# Altium schematic sheet ComponentsSchLib.SchDoc
size A4
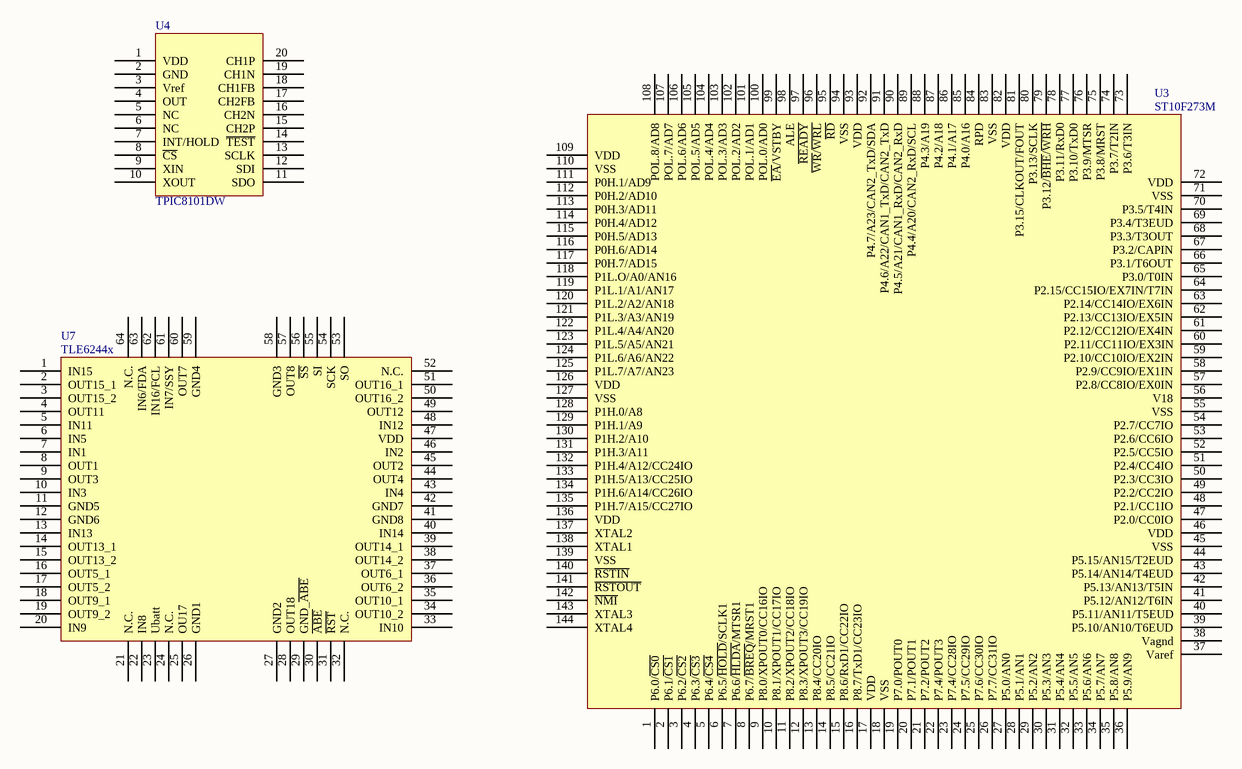
[diagram p0: ComponentsSchLib.SchDoc]

## Parts
U3  ST10F273M  [SOMQ144-Y]
U4  TPIC8101DW  [SO20_N]
U7  TLE6244x  [MQFP-64-10]

## Nets
gnd: U7.65(GND)

Not connected (* = marked no-connect by the designer): U3 1(P6.0/~{CS0}) 2(P6.1/~{CS1}) 3(P6.2/~{CS2}) 4(P6.3/~{CS3}) 5(P6.4/~{CS4}) 6(P6.5/~{HOLD}/SCLK1) 7(P6.6/~{HLDA}/MTSR1) 8(P6.7/~{BREQ}/MRST1) 9(P8.0/XPOUT0/CC16IO) 10(P8.1/XPOUT1/CC17IO) 11(P8.2/XPOUT2/CC18IO) 12(P8.3/XPOUT3/CC19IO) 13(P8.4/CC20IO) 14(P8.5/CC21IO) 15(P8.6/RxD1/CC22IO) 16(P8.7/TxD1/CC23IO) 17(VDD) 18(VSS) 19(P7.0/POUT0) 20(P7.1/POUT1) 21(P7.2/POUT2) 22(P7.4/POUT3) 23(P7.4/CC28IO) 24(P7.5/CC29IO) 25(P7.6/CC30IO) 26(P7.7/CC31IO) 27(P5.0/AN0) 28(P5.1/AN1) 29(P5.2/AN2) 30(P5.3/AN3) 31(P5.4/AN4) 32(P5.5/AN5) 33(P5.6/AN6) 34(P5.7/AN7) 35(P5.8/AN8) 36(P5.9/AN9) 37(Varef) 38(Vagnd) 39(P5.10/AN10/T6EUD) 40(P5.11/AN11/T5EUD) 41(P5.12/AN12/T6IN) 42(P5.13/AN13/T5IN) 43(P5.14/AN14/T4EUD) 44(P5.15/AN15/T2EUD) 45(VSS) 46(VDD) 47(P2.0/CC0IO) 48(P2.1/CC1IO) 49(P2.2/CC2IO) 50(P2.3/CC3IO) 51(P2.4/CC4IO) 52(P2.5/CC5IO) 53(P2.6/CC6IO) 54(P2.7/CC7IO) 55(VSS) 56(V18) 57(P2.8/CC8IO/EX0IN) 58(P2.9/CC9IO/EX1IN) 59(P2.10/CC10IO/EX2IN) 60(P2.11/CC11IO/EX3IN) 61(P2.12/CC12IO/EX4IN) 62(P2.13/CC13IO/EX5IN) 63(P2.14/CC14IO/EX6IN) 64(P2.15/CC15IO/EX7IN/T7IN) 65(P3.0/T0IN) 66(P3.1/T6OUT) 67(P3.2/CAPIN) 68(P3.3/T3OUT) 69(P3.4/T3EUD) 70(P3.5/T4IN) 71(VSS) 72(VDD) 73(P3.6/T3IN) 74(P3.7/T2IN) 75(P3.8/MRST) 76(P3.9/MTSR) 77(P3.10/TxD0) 78(P3.11/RxD0) 79(P3.12/~{BHE}/~{WRH}) 80(P3.13/SCLK) 81(P3.15/CLKOUT/FOUT) 82(VDD) 83(VSS) 84(RPD) 85(P4.0/A16) 86(P4.1/A17) 87(P4.2/A18) 88(P4.3/A19) 89(P4.4/A20/CAN2_RxD/SCL) 90(P4.5/A21/CAN1_RxD/CAN2_RxD) 91(P4.6/A22/CAN1_TxD/CAN2_TxD) 92(P4.7/A23/CAN2_TxD/SDA) 93(VDD) 94(VSS) 95(~{RD}) 96(~{WR}/~{WRL}) 97(~{READY}) 98(ALE) 99(~{EA}/VSTBY) 100(POL.0/AD0) 101(POL.1/AD1) 102(POL.2/AD2) 103(POL.3/AD3) 104(POL.4/AD4) 105(POL.5/AD5) 106(POL.6/AD6) 107(POL.7/AD7) 108(POL.8/AD8) 109(VDD) 110(VSS) 111(P0H.1/AD9) 112(P0H.2/AD10) 113(P0H.3/AD11) 114(P0H.4/AD12) 115(P0H.5/AD13) 116(P0H.6/AD14) 117(P0H.7/AD15) 118(P1L.O/A0/AN16) 119(P1L.1/A1/AN17) 120(P1L.2/A2/AN18) 121(P1L.3/A3/AN19) 122(P1L.4/A4/AN20) 123(P1L.5/A5/AN21) 124(P1L.6/A6/AN22) 125(P1L.7/A7/AN23) 126(VDD) 127(VSS) 128(P1H.0/A8) 129(P1H.1/A9) 130(P1H.2/A10) 131(P1H.3/A11) 132(P1H.4/A12/CC24IO) 133(P1H.5/A13/CC25IO) 134(P1H.6/A14/CC26IO) 135(P1H.7/A15/CC27IO) 136(VDD) 137(XTAL2) 138(XTAL1) 139(VSS) 140(~{RSTIN}) 141(~{RSTOUT}) 142(~{NMI}) 143(XTAL3) 144(XTAL4); U4 1(VDD) 2(GND) 3(Vref) 4(OUT) 5(NC) 6(NC) 7(INT/HOLD) 8(~{CS}) 9(XIN) 10(XOUT) 11(SDO) 12(SDI) 13(SCLK) 14(~{TEST}) 15(CH2P) 16(CH2N) 17(CH2FB) 18(CH1FB) 19(CH1N) 20(CH1P); U7 1(IN15) 2(OUT15_1) 3(OUT15_2) 4(OUT11) 5(IN11) 6(IN5) 7(IN1) 8(OUT1) 9(OUT3) 10(IN3) 11(GND5) 12(GND6) 13(IN13) 14(OUT13_1) 15(OUT13_2) 16(OUT5_1) 17(OUT5_2) 18(OUT9_1) 19(OUT9_2) 20(IN9) 21(N.C.) 22(IN8) 23(Ubatt) 24(N.C.) 25(OU17) 26(GND1) 27(GND2) 28(OUT18) 29(GND_~{ABE}) 30(~{ABE}) 31(~{RST}) 32(N.C.) 33(IN10) 34(OUT10_2) 35(OUT10_1) 36(OUT6_2) 37(OUT6_1) 38(OUT14_2) 39(OUT14_1) 40(IN14) 41(GND8) 42(GND7) 43(IN4) 44(OUT4) 45(OUT2) 46(IN2) 47(VDD) 48(IN12) 49(OUT12) 50(OUT16_2) 51(OUT16_1) 52(N.C.) 53(SO) 54(SCK) 55(SI) 56(~{SS}) 57(OUT8) 58(GND3) 59(GND4) 60(OUT7) 61(IN7/SSY) 62(IN16/FCL) 63(IN6/FDA) 64(N.C.)

## Library data of the parts
U3 = ST10F273M: Microcontroller
U4 = TPIC8101DW: Knock, SO20; Manufacturer: TI; Code: 301; Part Number: TPIC8101DW; Type: Knock Sensor Interface; Features: Dual-Channel Knock Sensor Interface; Package: SO20
U7 = TLE6244x: PG-MQFP-64-10; Manufacturer: Infineon; Code: 12; Priority: 1; Package: PG-MQFP-64-10; Part Number: TLE6244X; Type: 18 Channel Smart Lowside Switch; Features: AEC Qualified